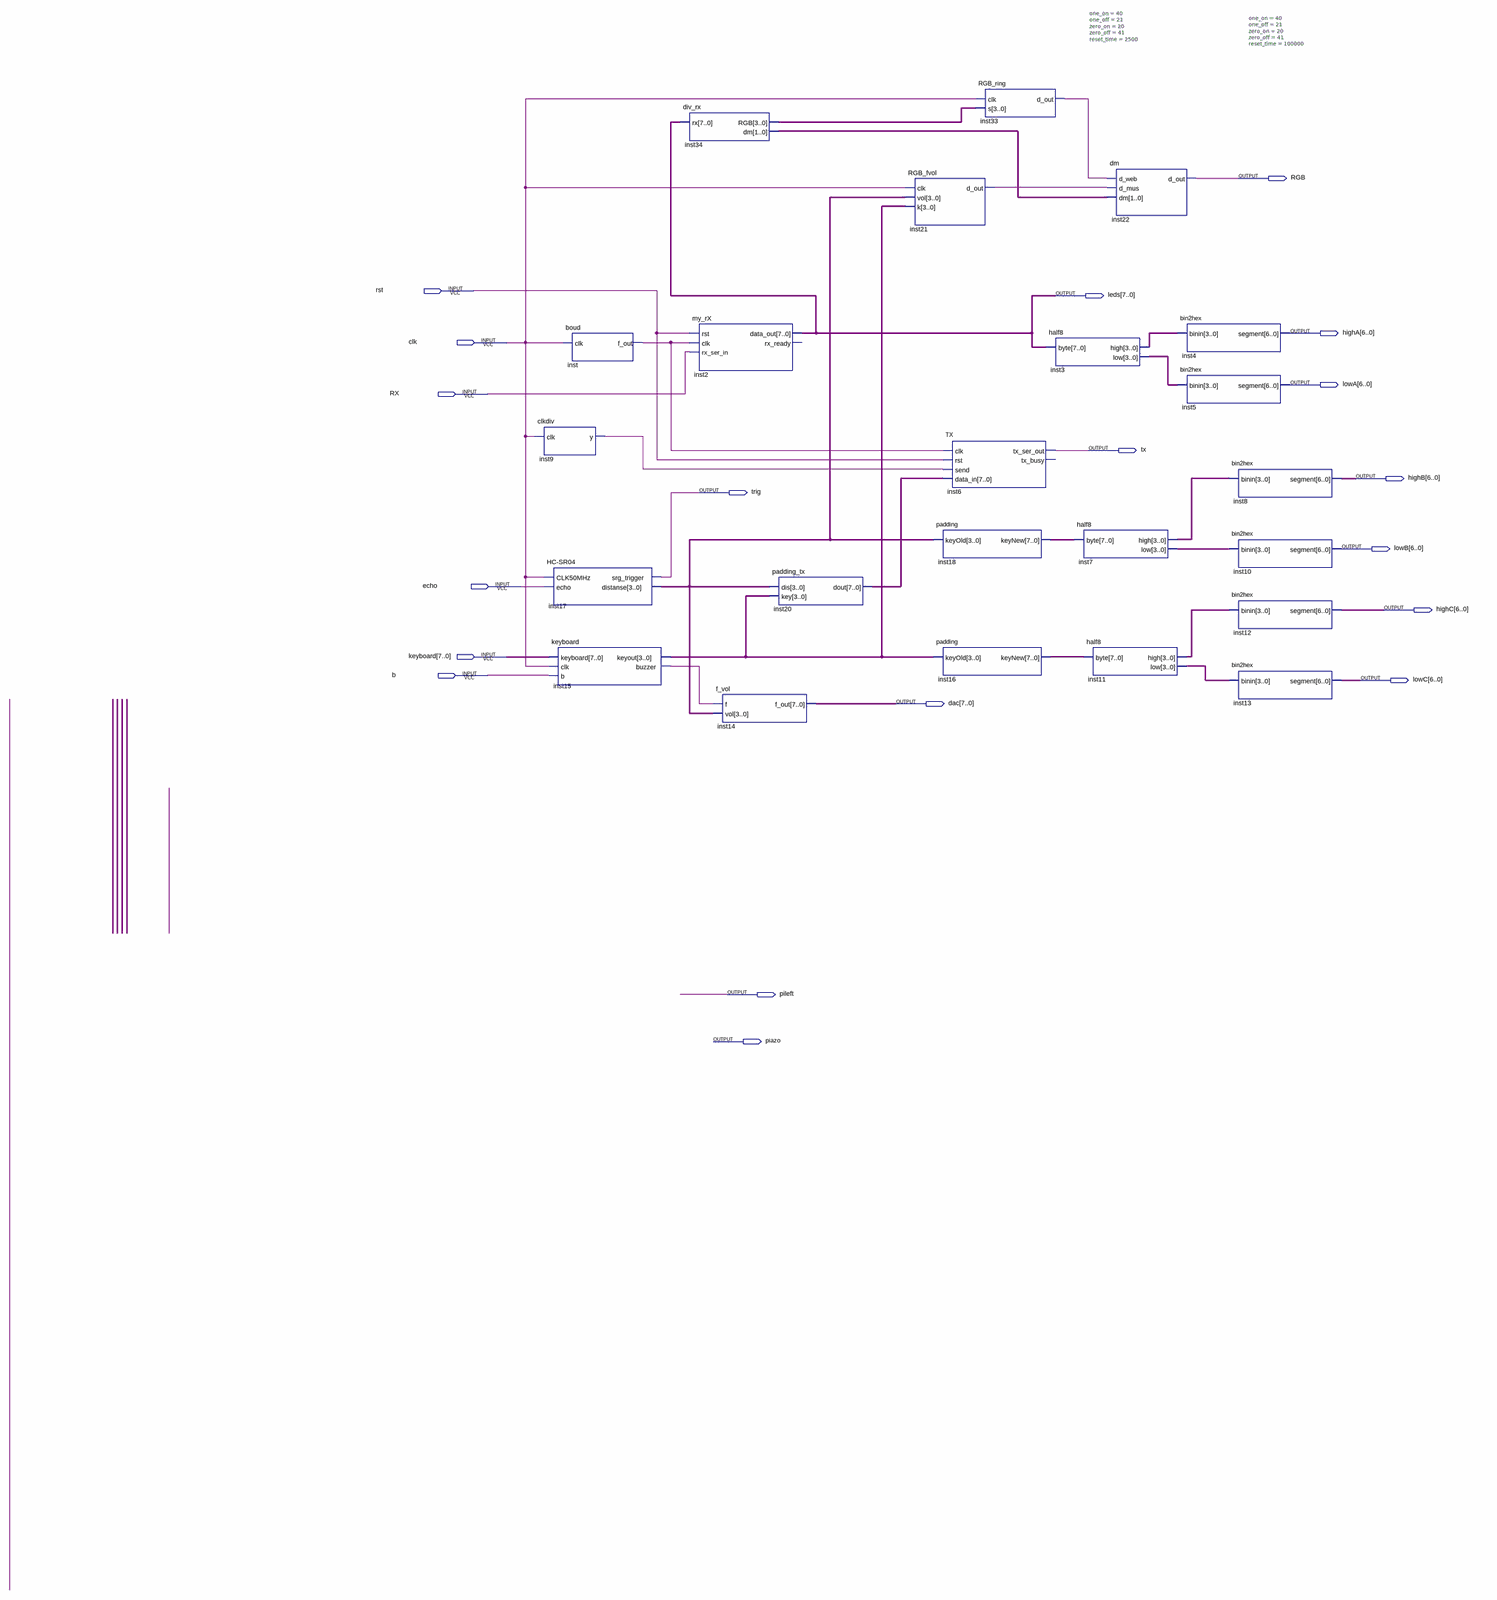
[diagram p0: schematic sheet, whole]
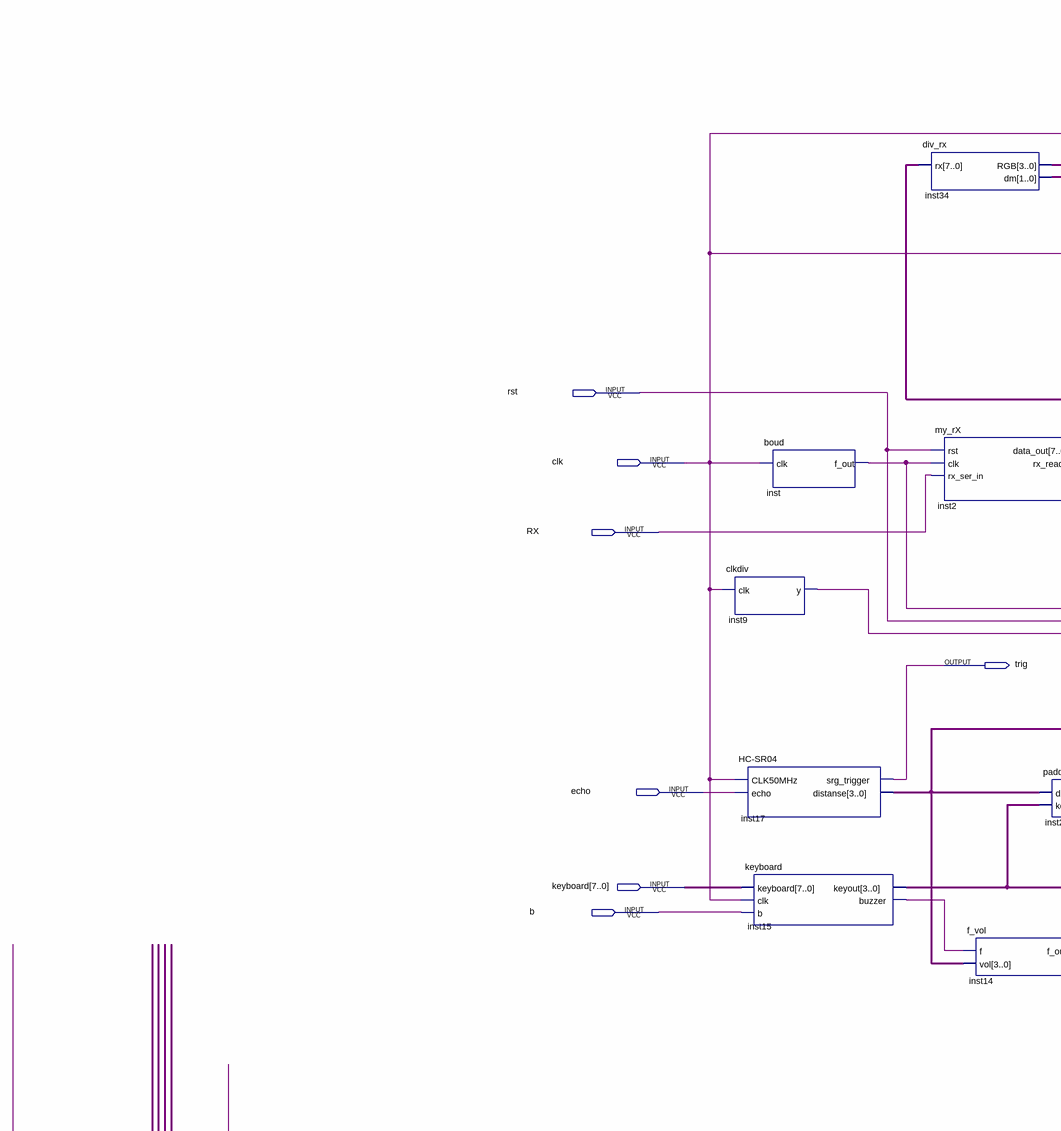
[diagram p1: schematic sheet, upper left part]
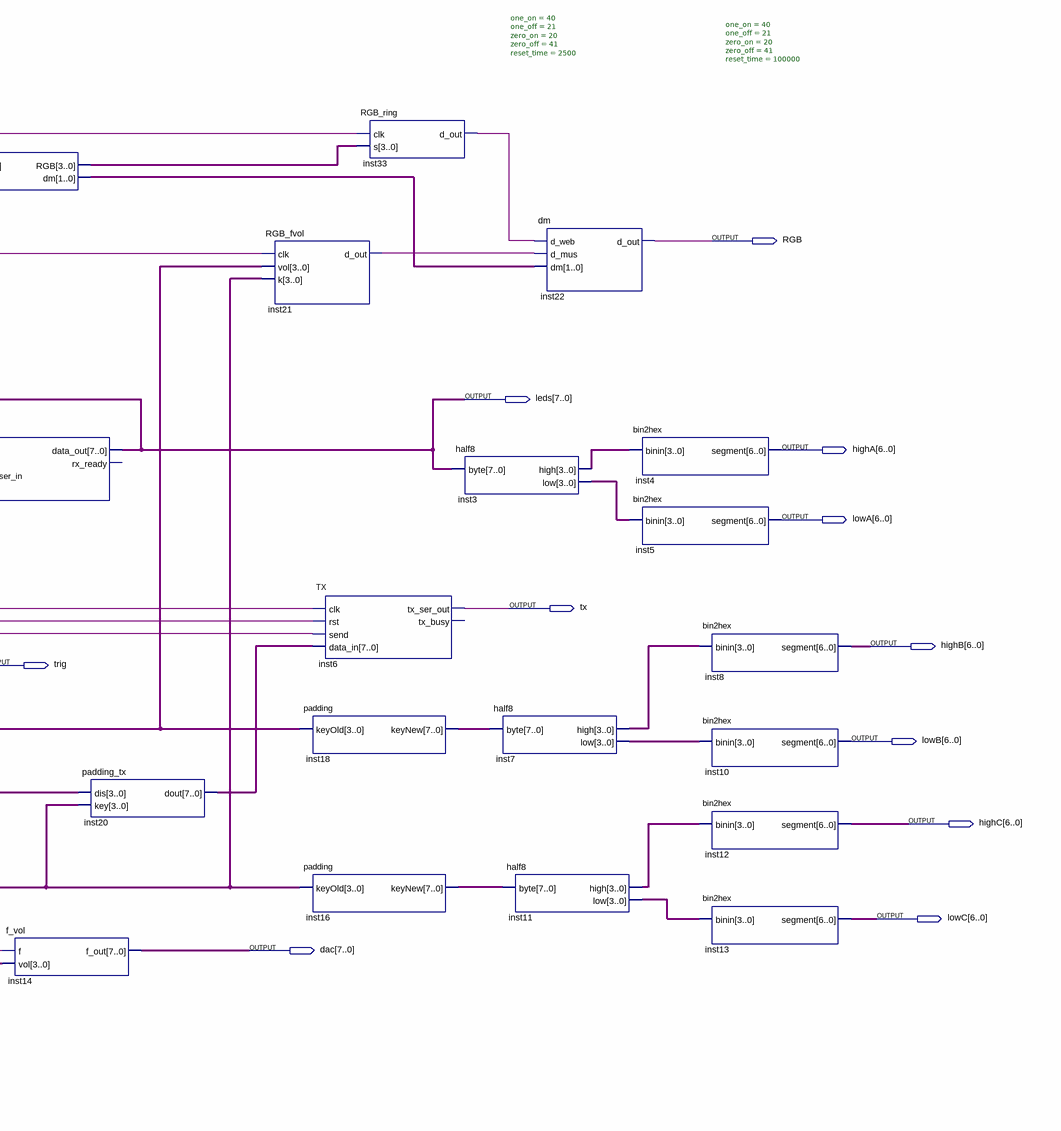
[diagram p2: schematic sheet, upper right part]
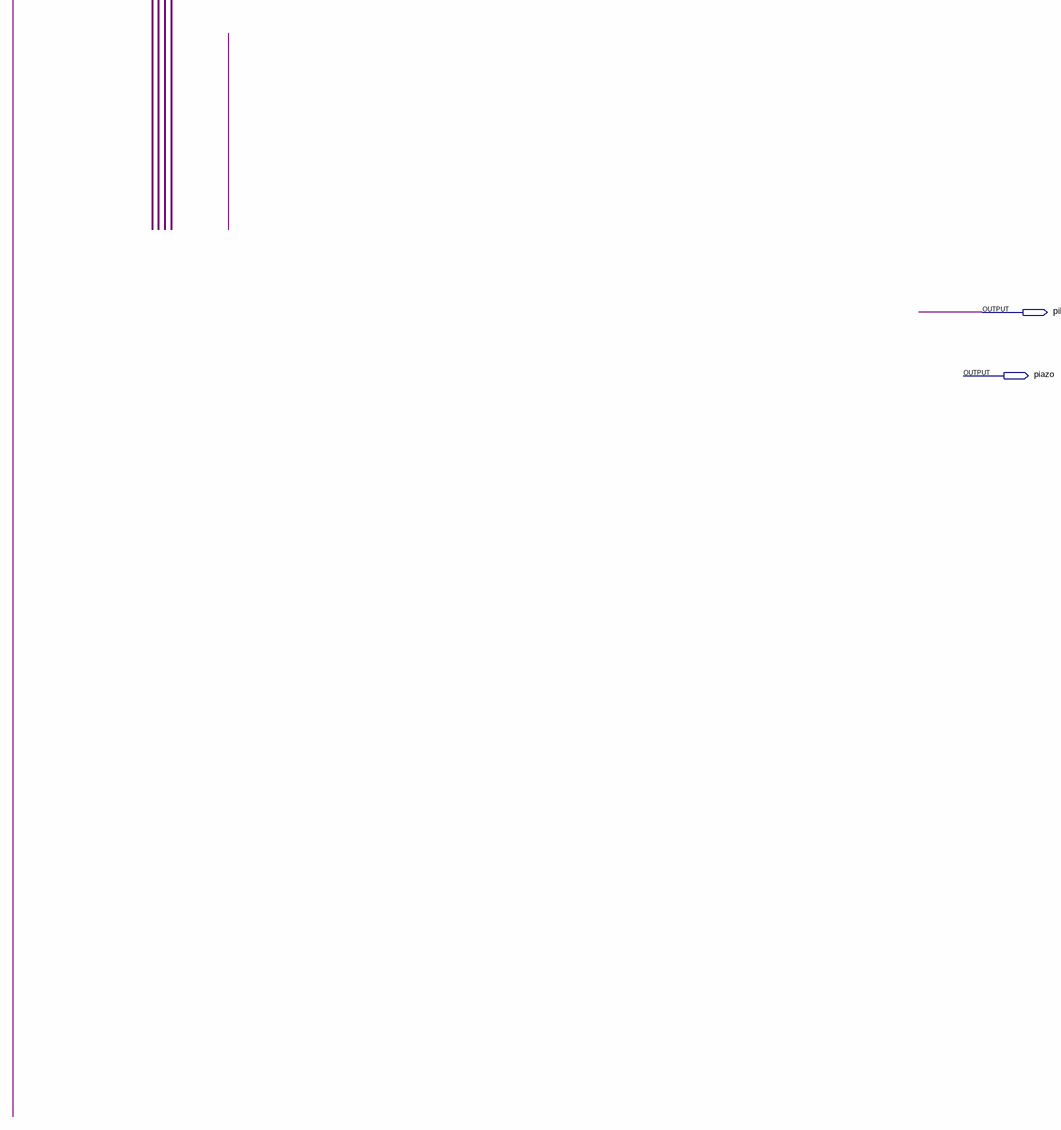
[diagram p3: schematic sheet, lower left part]
// Quartus schematic rxtx.bdf as structural Verilog: 23 symbols, 19 pins
module rxtx (
  input  rst,
  input  clk,
  input  RX,
  input  echo,
  input  [7:0] keyboard,
  input  b,
  output RGB,
  output [7:0] leds,
  output [6:0] highA,
  output [6:0] lowA,
  output tx,
  output [6:0] highB,
  output trig,
  output [6:0] lowB,
  output [6:0] highC,
  output [6:0] lowC,
  output [7:0] dac,
  output pileft,
  output piazo
);

  wire inst9_y, inst15_buzzer, inst21_d_out, inst33_d_out, inst_f_out;
  wire [1:0] inst34_dm;
  wire [3:0] inst3_high, inst3_low, inst7_high, inst7_low, inst11_high, inst11_low, inst15_keyout,
       inst17_distanse, inst34_rgb;
  wire [7:0] inst16_keynew, inst18_keynew, inst20_dout;

  clkdiv inst9 (.clk(clk), .y(inst9_y));
  \HC-SR04  inst17 (.CLK50MHz(clk), .echo(echo), .srg_trigger(trig), .distanse(inst17_distanse));
  keyboard inst15 (.keyboard(keyboard), .clk(clk), .b(b), .keyout(inst15_keyout), .buzzer(inst15_buzzer));
  boud inst (.clk(clk), .f_out(inst_f_out));
  div_rx inst34 (.rx(leds), .RGB(inst34_rgb), .dm(inst34_dm));
  my_rX inst2 (.rst(rst), .clk(inst_f_out), .rx_ser_in(RX), .data_out(leds));  // open: rx_ready
  f_vol inst14 (.f(inst15_buzzer), .vol(inst17_distanse), .f_out(dac));
  padding_tx inst20 (.dis(inst17_distanse), .key(inst15_keyout), .dout(inst20_dout));
  RGB_fvol #(.one_on(40), .one_off(21), .zero_on(20), .zero_off(41), .reset_time(100000)) inst21 (
    .clk(clk), .vol(inst17_distanse), .k(inst15_keyout), .d_out(inst21_d_out));
  TX inst6 (.clk(inst_f_out), .rst(rst), .send(inst9_y), .data_in(inst20_dout), .tx_ser_out(tx));  // open: tx_busy
  padding inst18 (.keyOld(inst17_distanse), .keyNew(inst18_keynew));
  padding inst16 (.keyOld(inst15_keyout), .keyNew(inst16_keynew));
  RGB_ring #(.one_on(40), .one_off(21), .zero_on(20), .zero_off(41), .reset_time(2500)) inst33 (
    .clk(clk), .s(inst34_rgb), .d_out(inst33_d_out));
  half8 inst3 (.\byte (leds), .high(inst3_high), .low(inst3_low));
  half8 inst7 (.\byte (inst18_keynew), .high(inst7_high), .low(inst7_low));
  dm inst22 (.d_web(inst33_d_out), .d_mus(inst21_d_out), .dm(inst34_dm), .d_out(RGB));
  half8 inst11 (.\byte (inst16_keynew), .high(inst11_high), .low(inst11_low));
  bin2hex inst4 (.binin(inst3_high), .segment(highA));
  bin2hex inst5 (.binin(inst3_low), .segment(lowA));
  bin2hex inst8 (.binin(inst7_high), .segment(highB));
  bin2hex inst10 (.binin(inst7_low), .segment(lowB));
  bin2hex inst12 (.binin(inst11_high), .segment(highC));
  bin2hex inst13 (.binin(inst11_low), .segment(lowC));
endmodule
